# EasyEDA Pro project ProPrj_BLDCcontroller_2025-09-27.epro

# Schematic Schematic1
Board Name: Board1; Create Date: 2025-09-21; Page Name: P1; Project Name: BLDC驱动器; Schematic Name: Schematic1; Update Date: 2025-09-23; Company: 嘉立创EDA; Page Size: A4; Version: V1.0
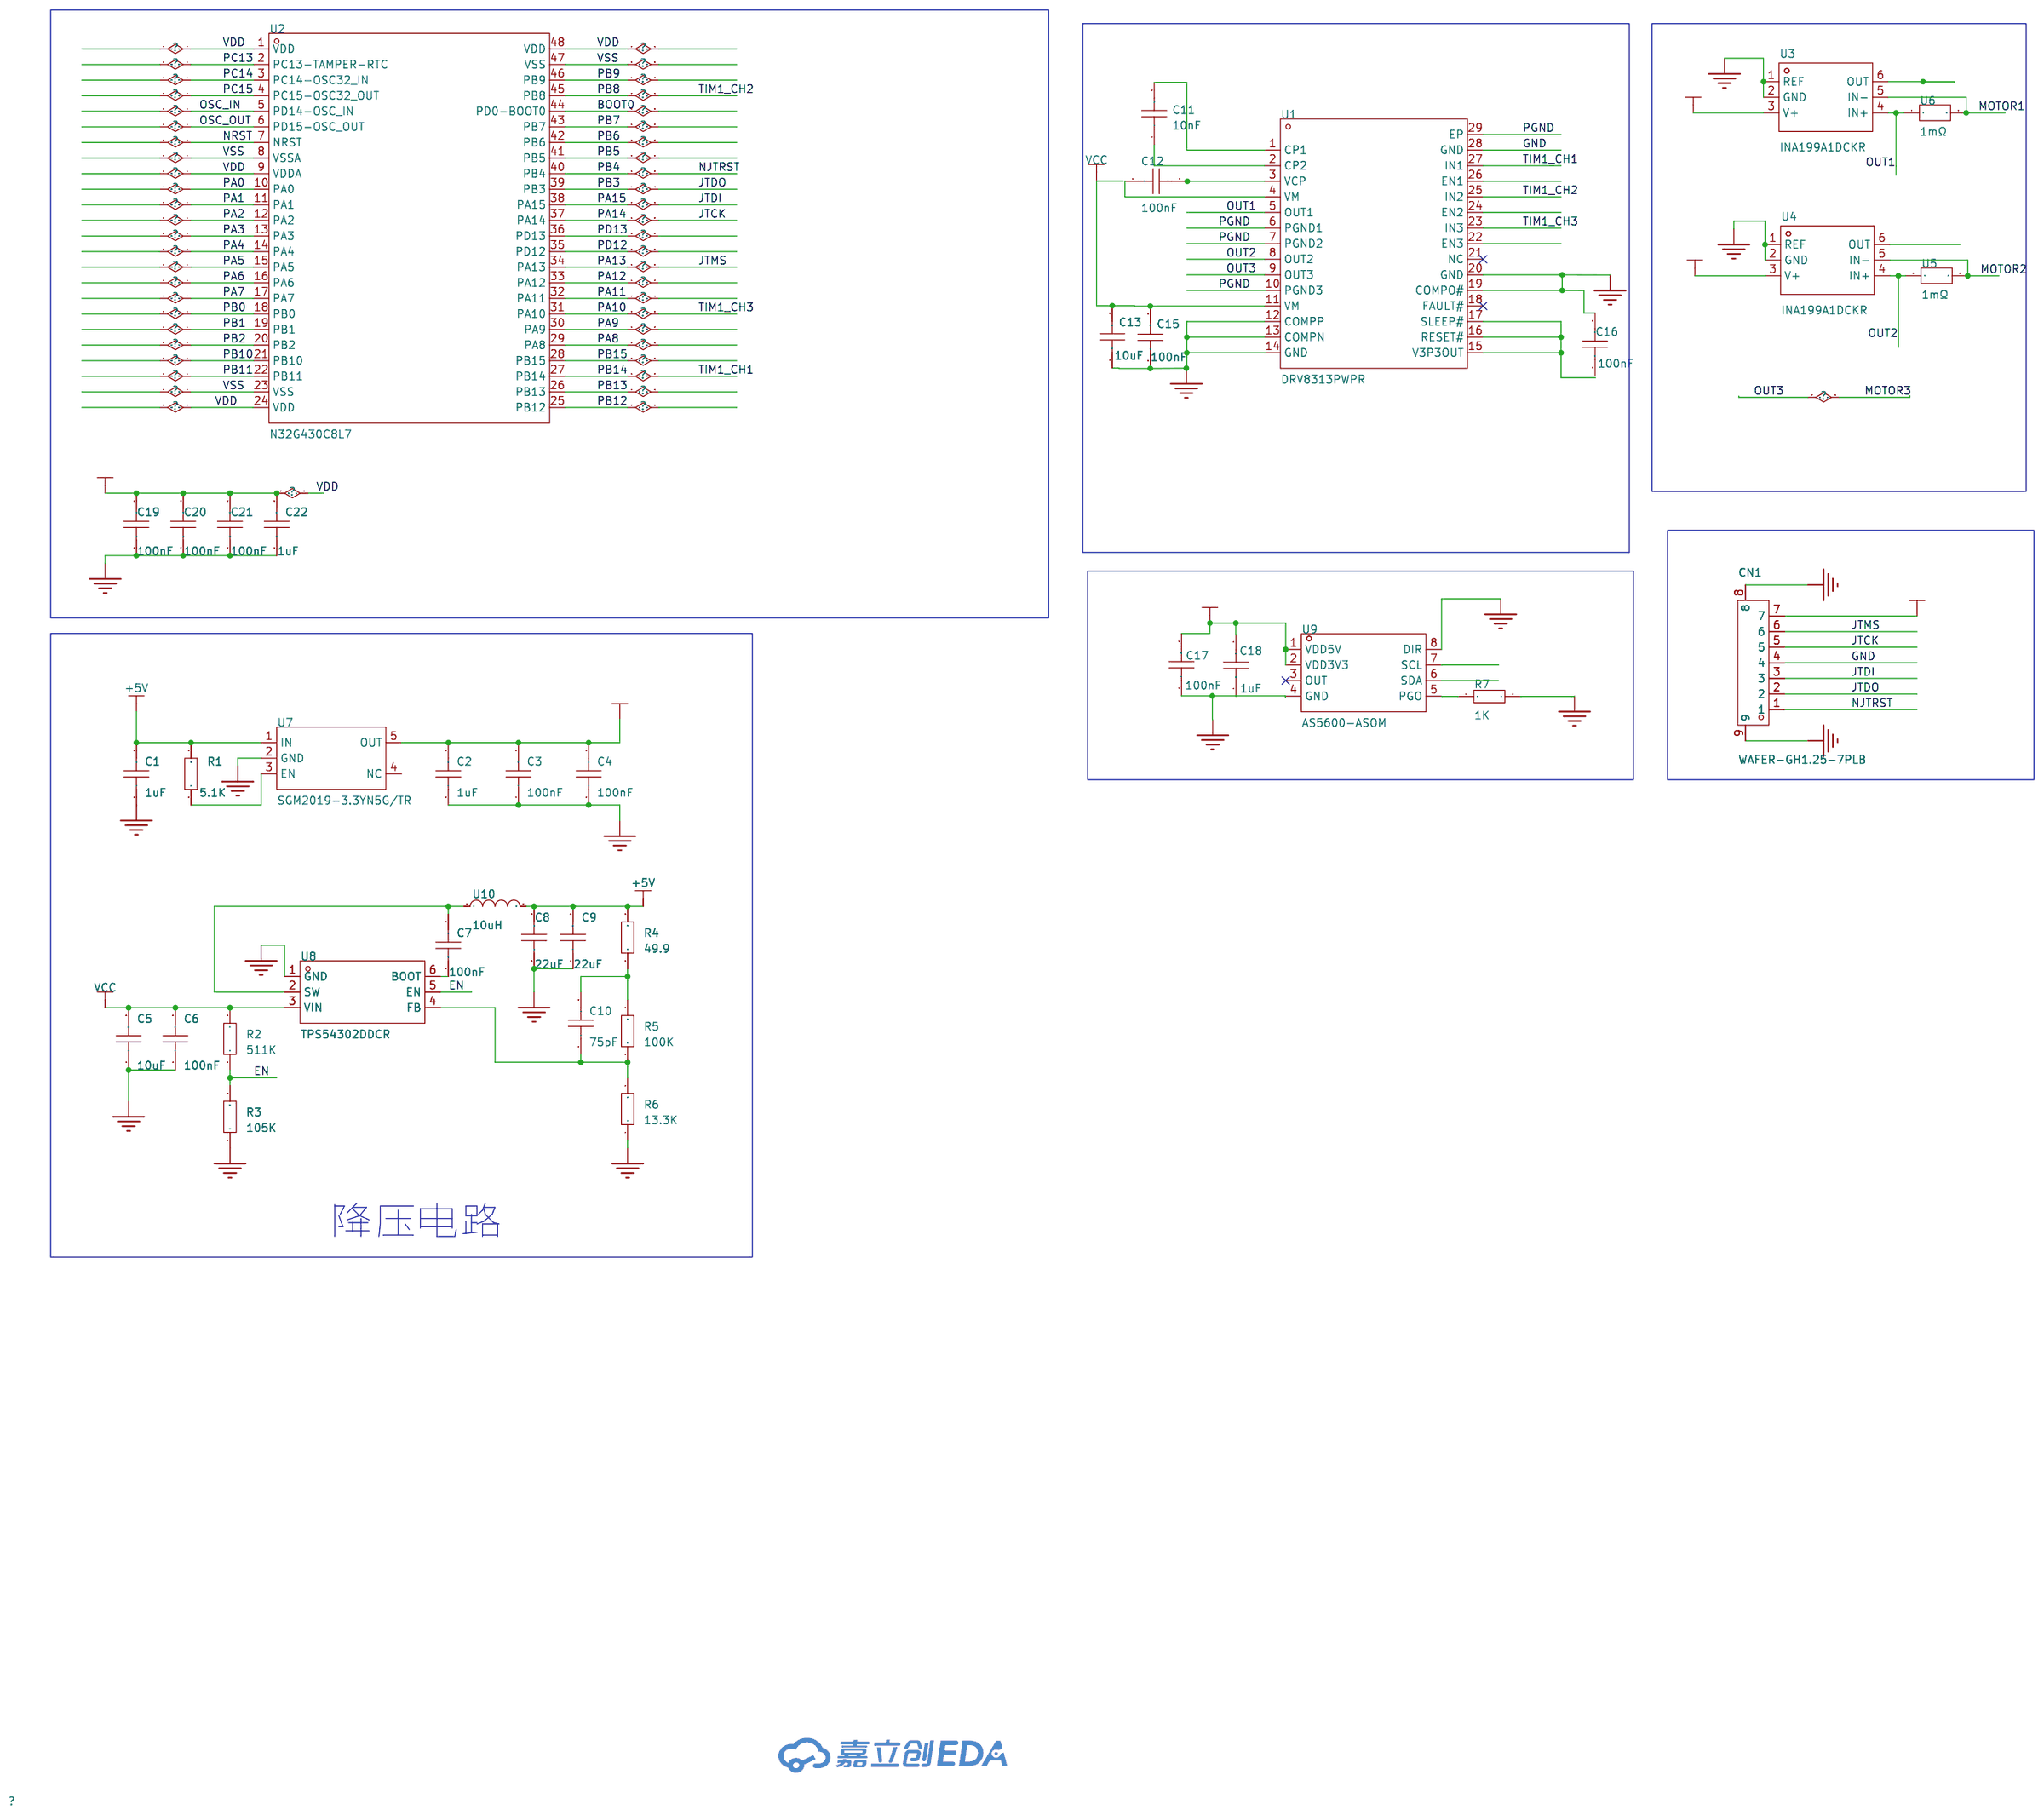
[diagram p0: schematic sheet]

## Parts
C1  1uF  [C0603]
C2  1uF  [C0603]
C3  100nF  [C0603]
C4  100nF  [C0603]
C5  10uF  [C0805]
C6  100nF  [C0603]
C7  100nF  [C0603]
C8  22uF  [C0805]
C9  22uF  [C0805]
C10  75pF  [C0805]
C11  10nF  [C0603]
C12  100nF  [C0603]
C13  10uF  [C0805]
C15  100nF  [C0603]
C16  100nF  [C0603]
C17  100nF  [C0603]
C18  1uF  [C0603]
C19  100nF  [C0603]
C20  100nF  [C0603]
C21  100nF  [C0603]
C22  1uF  [C0603]
CN1  WAFER-GH1.25-7PLB  [CONN-SMD_7P-P1.25_XUNPU_WAFER-GH1.25-7PLB]
R1  5.1K  [R0603]
R2  511K  [R0603]
R3  105K  [R0603]
R4  49.9  [R0603]
R5  100K  [R0603]
R6  13.3K  [R0603]
R7  1K  [R0603]
U1  DRV8313PWPR  [HTSSOP-28_L9.8-W4.5-P0.65-LS6.6-BL-EP]
U2  N32G430C8L7  [LQFP-48_L7.0-W7.0-P0.50-LS9.0-BL]
U3  INA199A1DCKR  [SC-70-6_L2.2-W1.3-P0.65-LS2.1-BR]
U4  INA199A1DCKR  [SC-70-6_L2.2-W1.3-P0.65-LS2.1-BR]
U5  1mΩ  [R1206]
U6  1mΩ  [R1206]
U7  SGM2019-3.3YN5G/TR  [SOT-23-5_L2.9-W1.6-P0.95-LS2.8-BR]
U8  TPS54302DDCR  [SOT-23-6_L2.9-W1.6-P0.95-LS2.8-BL]
U9  AS5600-ASOM  [SOIC-8_L5.0-W4.0-P1.27-LS6.0-BL]
U10  10uH  [IND-SMD_L4.4-W4.2]

## Library data of the parts
C1-C4 C6 C7 C11 C12 C15-C22 = CAP_0603: Supplier Footprint: 0603
C5 C8-C10 C13 = CAP_0805: Supplier Footprint: 0805
CN1 = WAFER-GH1.25-7PLB: 插针结构:1x7P;间距:1.25mm;安装方式:立贴;参考系列:GH;总PIN数:7P;排数:1;每排PIN数:7;行距:-;额定电流:1A;触头材质:黄铜;触头镀层:锡;工作温度:-25℃~+85℃;; LCSC Part Name: 1x7P 间距:1.25mm 立贴 系列:GH; Supplier Part: C3029373; Manufacturer: XUNPU(讯普); Supplier Footprint: SMD,P=1.25mm; JLCPCB Part Class: 扩展库; Datasheet: https://item.szlcsc.com/datasheet/WAFER-GH1.25-7PLB/3561385.html; Supplier: LCSC; Pins Structure: 1x7P; Pitch: 1.25mm; Mounting Type: 立贴; Reference Series: GH; Number of Pins: 7P; Number of Rows: 1; Number of PINs Per Row: 7; Current Rating: 1A; Contact Material: 黄铜; Contact Plating: 锡; Operating Temperature: -25℃~+85℃; Voltage Rating: 125V; Plastic Material: LCP; Supplementary Features: 辅助焊脚; Color: 米色; Z-Height of the Board: 4.2mm; X-Length of Bottom Edge on Board (Spacing Line): 12mm; Y-Width of Bottom Edge on Board: 4.95mm
R1-R7 = Res_0603: Supplier Footprint: 0603
U1 = DRV8313PWPR: DRV8313 具有集成 FET、65V 最大电压、3A 峰值电流的三相电机驱动器; LCSC Part Name: 无刷直流BLDC电机驱动芯片 60V; Supplier Part: C92482; Manufacturer: TI(德州仪器); Supplier Footprint: HTSSOP-28; JLCPCB Part Class: 扩展库; Datasheet: https://www.ti.com/cn/lit/gpn/drv8313; Supplier: LCSC; Drive Type: 三相; Integrated FETs: 是; Number of Half Bridges: 3; Peak Current: 2.5A; Quiescent Current(Iq): 800uA; Operating Temperature: -40℃~+125℃
U2 = N32G430C8L7: CPU内核:ARM-M4;应用领域:-;; Supplier Part: C3032170; Manufacturer: Nations(国民技术); Supplier Footprint: LQFP-48(7x7); JLCPCB Part Class: 扩展库; Datasheet: https://atta.szlcsc.com/upload/public/pdf/source/20220608/411F2C1C49F3955F5F0689A973473AF7.pdf; Supplier: LCSC; CPU Core: ARM-M4; Program Storage Size: 64KB; Program Memory Type: FLASH
U3 U4 = INA199A1DCKR: INA199 26V、双向电流感应放大器; Supplier Part: C59135; Manufacturer: TI(德州仪器); Supplier Footprint: SOT-363(SC-70-6); JLCPCB Part Class: 扩展库; Datasheet: https://www.ti.com/cn/lit/gpn/ina199; Supplier: LCSC; Supply Voltage: -300mV~26V; Supply Current: 300uA; Operating Temperature: -40℃~+125℃
U5 U6 = FRM121WFR001TM: 电阻类型:采样电阻;阻值:1mΩ;精度:±1%;工作电压:-;功率:1W;温度系数:±50ppm/℃;安装方式:-;; LCSC Part Name: 1mΩ ±1% 1W; Supplier Part: C7467246; Manufacturer: FOJAN(富捷); Supplier Footprint: 1206; JLCPCB Part Class: 扩展库; Datasheet: https://item.szlcsc.com/datasheet/FRM121WFR001TM/8513846.html; Supplier: LCSC; Type: 采样电阻; Tolerance: ±1%; Power(Watts): 1W; Temperature Coefficient: ±50ppm/℃
U7 = SGM2019-3.3YN5G/TR_C22447124: 输出类型:固定;工作电压:5.5V;输出电压:3.3V;输出电流:300mA;电源纹波抑制比(PSRR):80dB@(100Hz);输出极性:正极;; LCSC Part Name: JSM2019-3.3YN5G/TR; Supplier Part: C22447124; Manufacturer: JSMSEMI(杰盛微); Supplier Footprint: SOT-23-5; JLCPCB Part Class: 扩展库; Datasheet: https://atta.szlcsc.com/upload/public/pdf/source/20250120/A8D61688CD4A9C1FB653FDBB17463426.pdf; Supplier: LCSC; Output Type: 固定; Voltage - Supply: 5.5V; Output Voltage: 3.3V; Output Current: 300mA; Power Supply Rejection Ratio (PSRR): 80dB@(100Hz); Output Configuration: 正极; Number of Outputs: 1
U8 = TPS54302DDCR: 功能类型:降压型;输出类型:固定;工作电压:4.5V~28V;输出电压:5V;输出电流:3A;; LCSC Part Name: 4.5V至28V输入、3A输出、EMI友好的同步降压转换器; Supplier Part: C311983; Manufacturer: TI(德州仪器); Supplier Footprint: TSOT-23-6; JLCPCB Part Class: 扩展库; Datasheet: https://www.ti.com/cn/lit/gpn/tps54302; Supplier: LCSC; Function: 降压型; Output Type: 固定; Input Voltage: 4.5V~28V; Output Voltage: 5V; Output Current: 3A; Switching Frequency: 400kHz; Operating Temperature: -40℃~+125℃; Synchronous Rectification: 是; Number of Outputs: 1; Topology: 降压式; Quiescent Current (Iq): 45uA; Switch tube (built-in/external): 内置
U9 = AS5600-ASOM: 旋转角度范围:0°~360°;; Supplier Part: C79815; Manufacturer: ams(艾迈斯半导体); Supplier Footprint: SOIC-8; JLCPCB Part Class: 扩展库; Datasheet: https://atta.szlcsc.com/upload/public/pdf/source/20161027/1477535527192.pdf; Supplier: LCSC; Supply Voltage: 5V；3.3V; Rotation Angle: 0°~360°
U10 = XR0420-4R7M: 电感值:4.7uH;精度:±20%;额定电流:2.8A;饱和电流(Isat):3A;类型:一体成型电感;; LCSC Part Name: 4.7uH ±20% 3A; Supplier Part: C5307591; Manufacturer: XR(祥如); Supplier Footprint: SMD,0420; JLCPCB Part Class: 扩展库; Datasheet: https://atta.szlcsc.com/upload/public/pdf/source/20240328/110B611B724D24AB51078DA8F677E482.pdf; Supplier: LCSC; Tolerance: ±20%; Current Rating: 2.8A; Current - Saturation(Isat): 3A; DC Resistance(DCR): 105mΩ; Type: 一体成型电感

## Nets
3.3V: C2.2 C3.2 C4.2 C17.2 C19.2 C20.2 C21.2 C22.2 CN1.7 U2.1(VDD) U2.9(VDDA) U2.24(VDD) U2.48(VDD) U3.3(V+) U4.3(V+) U7.5(OUT) U9.1(VDD5V) U9.2(VDD3V3)
+5V: C1.2 C8.2 C9.2 R1.2 R4.2 U7.1(IN) U10.2
GND: C1.1 C2.1 C3.1 C4.1 C5.1 C6.1 C8.1 C9.1 C13.1 C15.1 C16.2 C17.1 C19.1 C20.1 C21.1 C22.1 CN1.4 CN1.8 CN1.9 R3.1 R6.1 R7.2 U1.12(COMPP) U1.13(COMPN) U1.14(GND) U1.19(COMPO#) U1.20(GND) U1.28(GND) U3.1(REF) U3.2(GND) U4.1(REF) U4.2(GND) U7.2(GND) U8.1(GND) U9.8(DIR)
PGND: U1.6(PGND1) U1.7(PGND2) U1.10(PGND3) U1.29(EP)
VCC: C5.2 C6.2 R2.2 U8.3(VIN)
VSS: U2.8(VSSA) U2.23(VSS) U2.47(VSS)
BOOT0: U2.44(PD0-BOOT0)
EN: R2.1 R3.2 U8.5(EN)
JTCK: CN1.5 U2.37(PA14)
JTDI: CN1.3 U2.38(PA15)
JTDO: CN1.2 U2.39(PB3)
JTMS: CN1.6 U2.34(PA13)
MOTOR1: U3.5(IN-) U6.2
MOTOR2: U4.5(IN-) U5.2
MOTOR3: U1.9(OUT3)
NJTRST: CN1.1 U2.40(PB4)
NRST: U2.7(NRST)
OSC_IN: U2.5(PD14-OSC_IN)
OSC_OUT: U2.6(PD15-OSC_OUT)
OUT1: U1.5(OUT1) U3.4(IN+) U6.1
OUT2: U1.8(OUT2) U4.4(IN+) U5.1
PA0: U2.10(PA0)
PA1: U2.11(PA1)
PA2: U2.12(PA2)
PA3: U2.13(PA3)
PA4: U2.14(PA4)
PA5: U2.15(PA5)
PA6: U2.16(PA6)
PA7: U2.17(PA7)
PA8: U2.29(PA8)
PA9: U2.30(PA9)
PA10: U1.23(IN3) U2.31(PA10)
PA11: U2.32(PA11)
PA12: U2.33(PA12)
PB0: U2.18(PB0)
PB1: U2.19(PB1)
PB2: U2.20(PB2)
PB5: U2.41(PB5)
PB6: U2.42(PB6)
PB7: U2.43(PB7)
PB8: U1.25(IN2) U2.45(PB8)
PB9: U2.46(PB9)
PB10: U2.21(PB10)
PB11: U2.22(PB11)
PB12: U2.25(PB12)
PB13: U2.26(PB13)
PB14: U1.27(IN1) U2.27(PB14)
PB15: U2.28(PB15)
PC13: U2.2(PC13-TAMPER-RTC)
PC14: U2.3(PC14-OSC32_IN)
PC15: U2.4(PC15-OSC32_OUT)
PD12: U2.35(PD12)
PD13: U2.36(PD13)
$1N321: U1.15(V3P3OUT) U1.16(RESET#) U1.17(SLEEP#)
$1N363: C12.2 U1.3(VCP)
$1N367: C11.2 U1.1(CP1)
$1N369: C11.1 U1.2(CP2)
$1N377: C12.1 U1.4(VM)
$1N3017: R1.1 U7.3(EN)
$1N3652: C7.2 U8.2(SW) U10.1
$1N3717: C7.1 U8.6(BOOT)
$1N4016: C10.2 R4.1 R5.2
$1N4167: C10.1 R5.1 R6.2 U8.4(FB)
$1N4739: C13.2 C15.2 U1.11(VM)

Not connected (* = marked no-connect by the designer): C16 1; C18 1 2; R7 1; U1 18(FAULT#)* 21(NC)* 22(EN3) 24(EN2) 26(EN1); U3 6(OUT); U4 6(OUT); U7 4(NC); U9 3(OUT)* 4(GND) 5(PGO) 6(SDA) 7(SCL)

## Notes on the sheet
- 降压电路

# Board PCB1
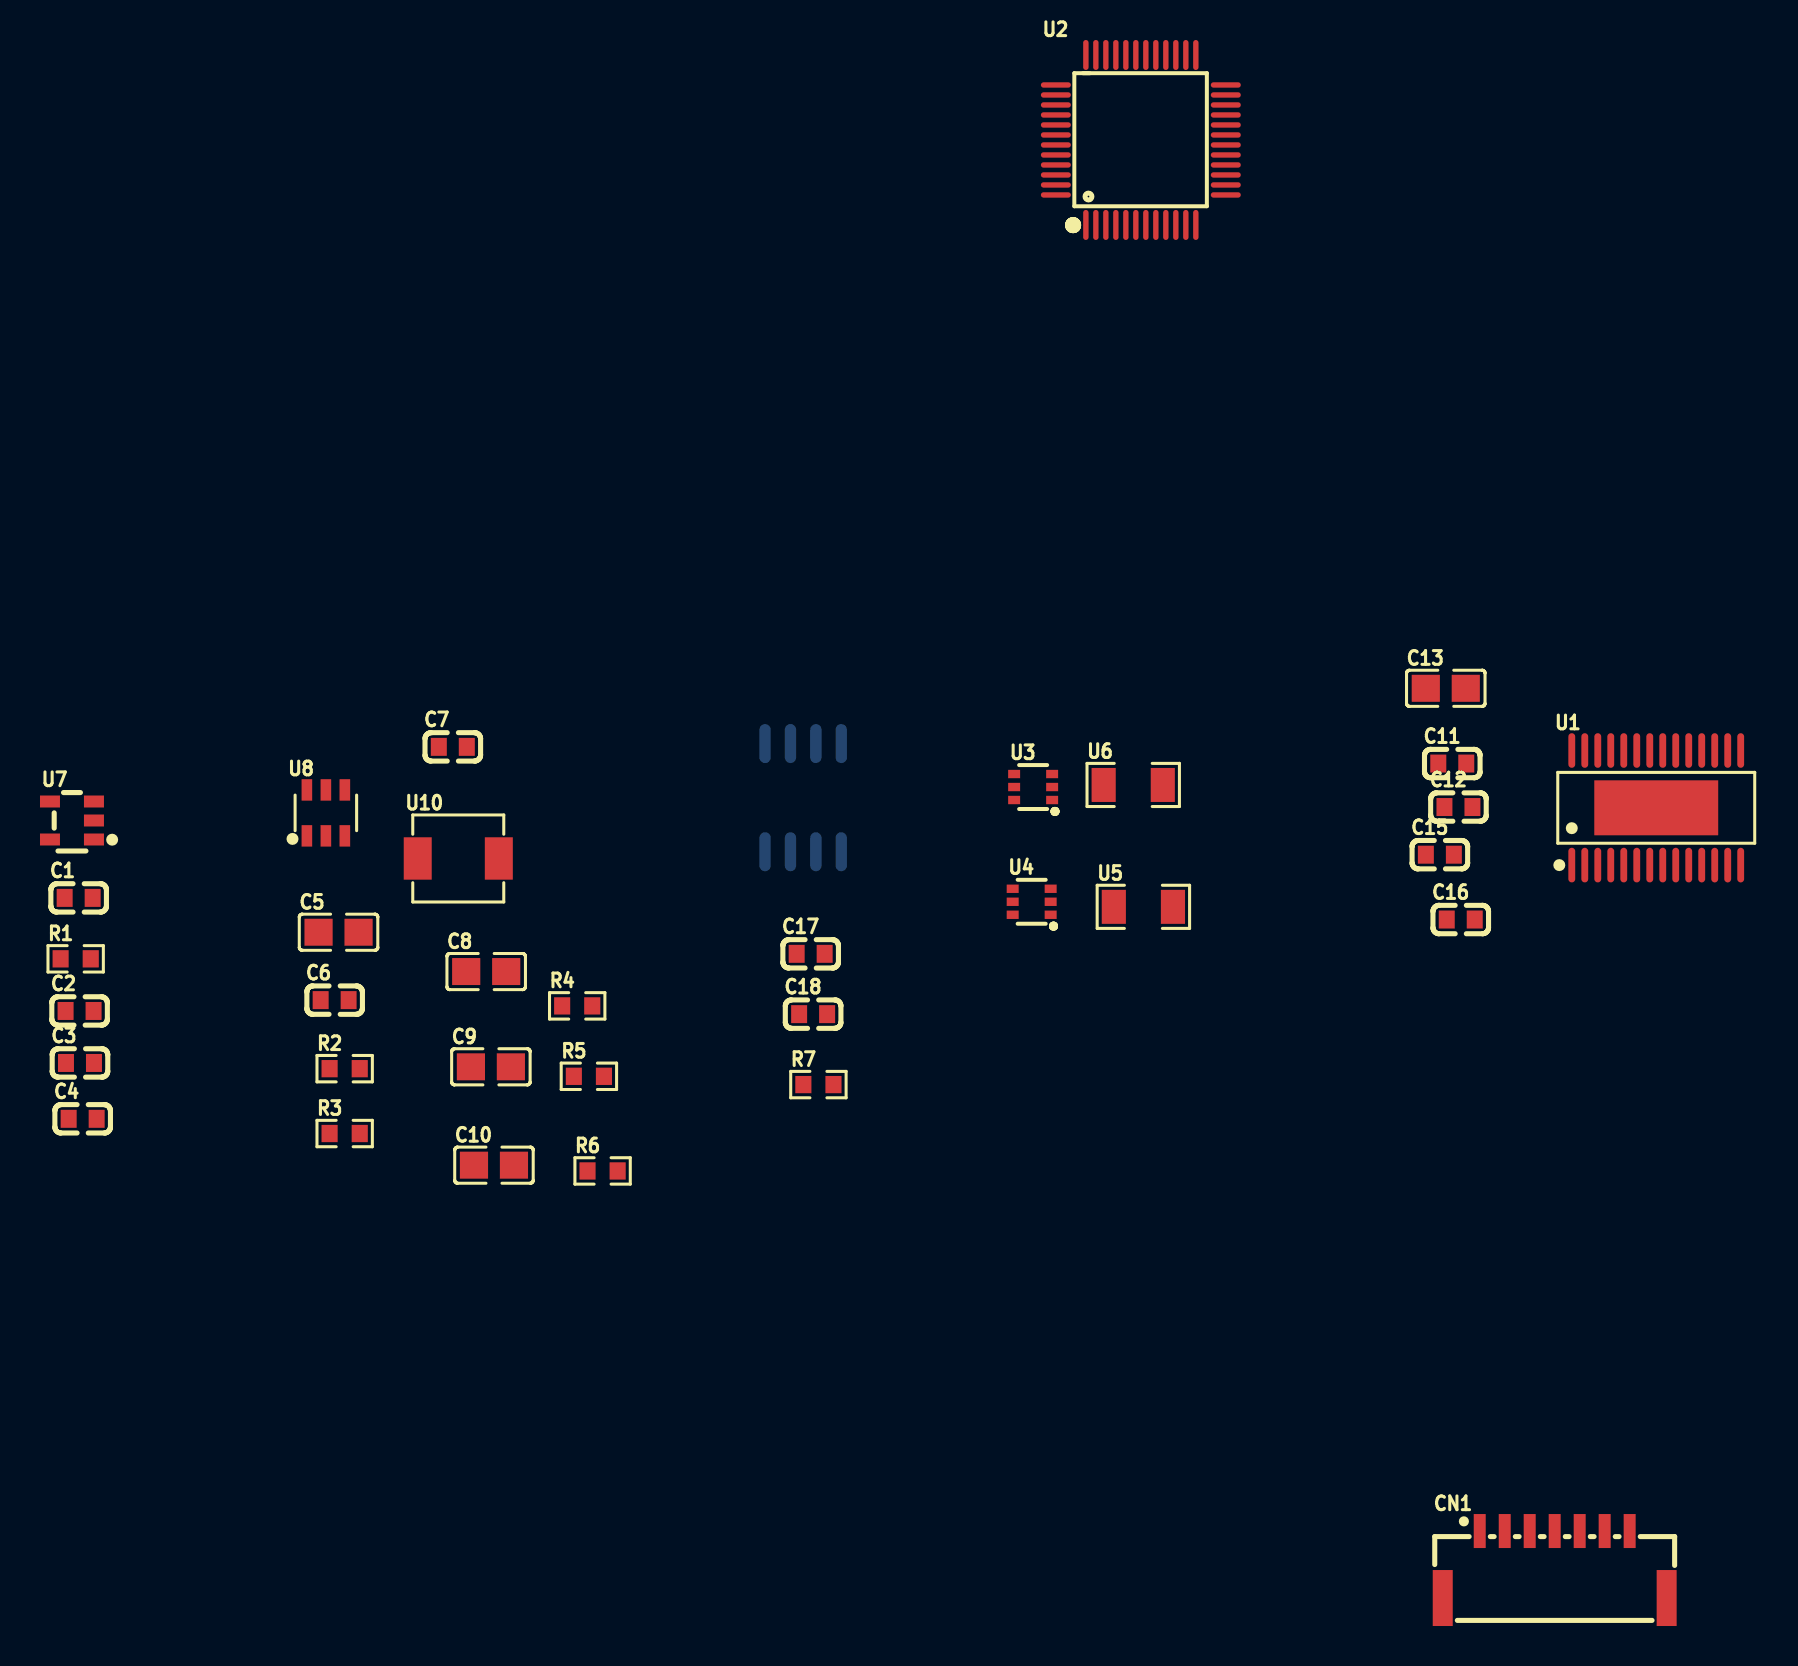
[diagram p1: board, top side]
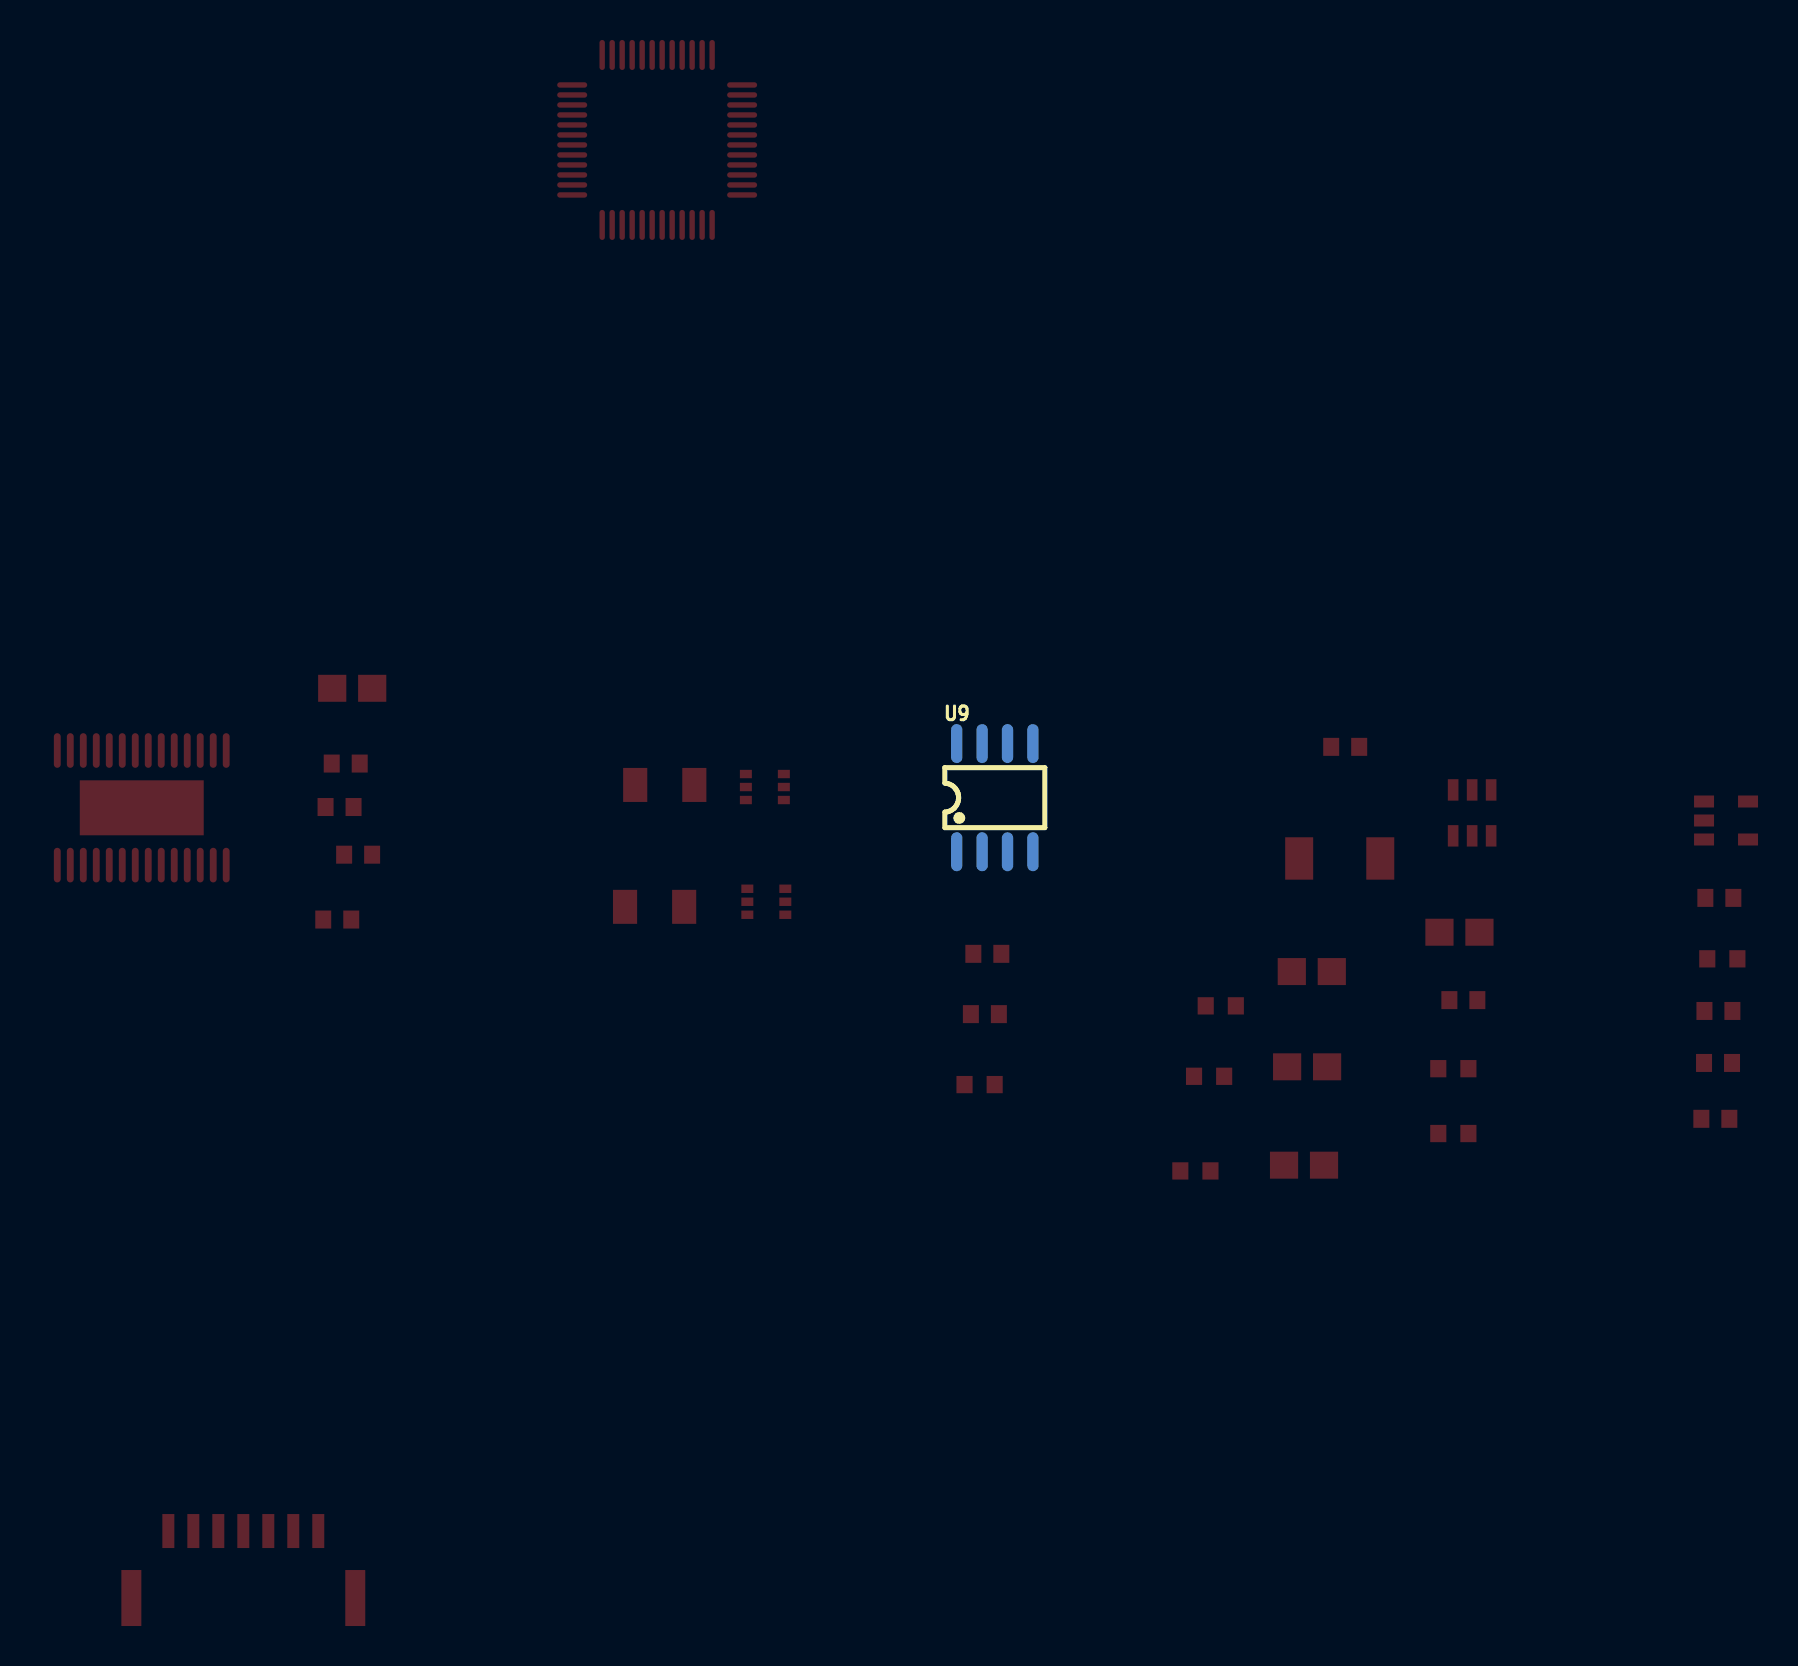
[diagram p2: board, bottom side, seen from below]

No outline. copper layers: Top Layer, Bottom Layer. Coordinates in mm from the lowest, leftmost part position.
Stack: Top Layer 0.035mm / Dielectric1 1.51mm FR4 er 4.5 / Bottom Layer 0.035mm

## Design rules (mm)
template: JLCPCB Capability(Two Layers Board)
spacing copperThickness1oz (default): track to track 0.102, other pairs 0.152 to 0.3
spacing copperThickness2oz: track to track 0.203, other pairs 0.152 to 0.3
track width copperThickness1oz (default): min 0.127, default 0.254, max 2.54
track width copperThickness2oz: min 0.203, default 0.254, max 2.54
differential pair differentialPair (default): width min 0.127, default 0.254, max 2.54; gap min 0.152, default 0.152
via viaSize (default): diameter min 0.5, default 0.61, max 10; hole min 0.3, default 0.305, max 6.3

## Placement (name value [footprint] x y rotation side)
C1  1uF  [C0603]  0.33 33.34 0 top
C2  1uF  [C0603]  0.38 27.69 0 top
C3  100nF  [C0603]  0.4 25.09 0 top
C4  100nF  [C0603]  0.54 22.29 0 top
C5  10uF  [C0805]  13.34 31.62 0 top
C6  100nF  [C0603]  13.14 28.23 0 top
C7  100nF  [C0603]  19.05 40.89 0 top
C8  22uF  [C0805]  20.72 29.66 0 top
C9  22uF  [C0805]  20.96 24.89 0 top
C10  75pF  [C0805]  21.11 19.97 0 top
C11  10nF  [C0603]  69.05 40.06 0 top
C12  100nF  [C0603]  69.35 37.88 0 top
C13  10uF  [C0805]  68.72 43.82 0 top
C15  100nF  [C0603]  68.42 35.5 0 top
C16  100nF  [C0603]  69.47 32.26 0 top
C17  100nF  [C0603]  36.95 30.54 0 top
C18  1uF  [C0603]  37.07 27.53 0 top
CN1  WAFER-GH1.25-7PLB  [CONN-SMD_7P-P1.25_XUNPU_WAFER-GH1.25-7PLB]  74.17 0 0 top
R1  5.1K  [R0603]  0.19 30.29 0 top
R2  511K  [R0603]  13.64 24.8 0 top
R3  105K  [R0603]  13.64 21.56 0 top
R4  49.9  [R0603]  25.27 27.94 0 top
R5  100K  [R0603]  25.86 24.42 0 top
R6  13.3K  [R0603]  26.54 19.69 0 top
R7  1K  [R0603]  37.34 24 0 top
U1  DRV8313PWPR  [HTSSOP-28_L9.8-W4.5-P0.65-LS6.6-BL-EP]  79.25 37.85 0 top
U2  N32G430C8L7  [LQFP-48_L7.0-W7.0-P0.50-LS9.0-BL]  53.47 71.25 0 top
U3  INA199A1DCKR  [SC-70-6_L2.2-W1.3-P0.65-LS2.1-BR]  48.08 38.88 0 top
U4  INA199A1DCKR  [SC-70-6_L2.2-W1.3-P0.65-LS2.1-BR]  48.01 33.15 0 top
U5  1mΩ  [R1206]  53.59 32.89 0 top
U6  1mΩ  [R1206]  53.09 38.99 0 top
U7  SGM2019-3.3YN5G/TR  [SOT-23-5_L2.9-W1.6-P0.95-LS2.8-BR]  0 37.21 0 top
U8  TPS54302DDCR  [SOT-23-6_L2.9-W1.6-P0.95-LS2.8-BL]  12.7 37.59 0 top
U9  AS5600-ASOM  [SOIC-8_L5.0-W4.0-P1.27-LS6.0-BL]  36.58 38.35 180 bottom
U10  10uH  [IND-SMD_L4.4-W4.2]  19.32 35.31 0 top

## Footprints (pads in the part's own frame, mm; a bottom-side part is the same pattern mirrored in y, then rotated)
C0603
  rect 0.8x0.9 smd: 1(-0.7,0) 2(0.7,0)
C0805
  rect 1.41x1.35 smd: 1(-1,0) 2(1,0)
CONN-SMD_7P-P1.25_XUNPU_WAFER-GH1.25-7PLB
  rect 0.6x1.7 smd: 1(-3.75,1.675) 2(-2.499,1.675) 3(-1.25,1.675) 4(0,1.675) 5(1.25,1.675) 6(2.5,1.675) 7(3.75,1.675)
  rect 1x2.8 smd: 8(5.6,-1.675) 9(-5.6,-1.675)
HTSSOP-28_L9.8-W4.5-P0.65-LS6.6-BL-EP
  oval 0.343x1.732 smd: 1(-4.225,-2.866) 2(-3.575,-2.866) 3(-2.925,-2.866) 4(-2.275,-2.866) 5(-1.625,-2.866) 6(-0.975,-2.866) 7(-0.325,-2.866) 8(0.325,-2.866) 9(0.975,-2.866) 10(1.625,-2.866) 11(2.275,-2.866) 12(2.925,-2.866) 13(3.575,-2.866) 14(4.225,-2.866) 15(4.225,2.866) 16(3.575,2.866) 17(2.925,2.866) 18(2.275,2.866) 19(1.625,2.866) 20(0.975,2.866) 21(0.325,2.866) 22(-0.325,2.866) 23(-0.975,2.866) 24(-1.625,2.866) 25(-2.275,2.866) 26(-2.925,2.866) 27(-3.575,2.866) 28(-4.225,2.866)
  rect 6.2x2.75 smd: 29(0,0)
IND-SMD_L4.4-W4.2
  rect 1.4x2.12 smd: 1(2.028,0) 2(-2.028,0)
LQFP-48_L7.0-W7.0-P0.50-LS9.0-BL
  oval 0.27x1.5 smd: 1(-2.75,-4.25) 2(-2.25,-4.25) 3(-1.75,-4.25) 4(-1.25,-4.25) 5(-0.75,-4.25) 6(-0.25,-4.25) 7(0.25,-4.25) 8(0.75,-4.25) 9(1.25,-4.25) 10(1.75,-4.25) 11(2.25,-4.25) 12(2.75,-4.25) 25(2.75,4.25) 26(2.25,4.25) 27(1.75,4.25) 28(1.25,4.25) 29(0.75,4.25) 30(0.25,4.25) 31(-0.25,4.25) 32(-0.75,4.25) 33(-1.25,4.25) 34(-1.75,4.25) 35(-2.25,4.25) 36(-2.75,4.25)
  oval 1.5x0.27 smd: 13(4.25,-2.75) 14(4.25,-2.25) 15(4.25,-1.75) 16(4.25,-1.25) 17(4.25,-0.75) 18(4.25,-0.25) 19(4.25,0.25) 20(4.25,0.75) 21(4.25,1.25) 22(4.25,1.75) 23(4.25,2.25) 24(4.25,2.75) 37(-4.25,2.75) 38(-4.25,2.25) 39(-4.25,1.75) 40(-4.25,1.25) 41(-4.25,0.75) 42(-4.25,0.25) 43(-4.25,-0.25) 44(-4.25,-0.75) 45(-4.25,-1.25) 46(-4.25,-1.75) 47(-4.25,-2.25) 48(-4.25,-2.75)
R0603
  rect 0.806x0.864 smd: 1(-0.753,0) 2(0.753,0)
R1206
  rect 1.208x1.701 smd: 1(-1.479,0) 2(1.479,0)
SC-70-6_L2.2-W1.3-P0.65-LS2.1-BR
  rect 0.6x0.42 smd: 1(0.95,-0.65) 2(0.95,0) 3(0.95,0.65) 4(-0.95,0.65) 5(-0.95,0) 6(-0.95,-0.65)
SOIC-8_L5.0-W4.0-P1.27-LS6.0-BL
  oval 0.569x1.95 smd: 1(-1.905,-2.705) 2(-0.635,-2.705) 3(0.635,-2.705) 4(1.905,-2.705) 5(1.905,2.705) 6(0.635,2.705) 7(-0.635,2.705) 8(-1.905,2.705)
SOT-23-5_L2.9-W1.6-P0.95-LS2.8-BR
  rect 1x0.6 smd: 1(1.1,-0.95) 2(1.1,0) 3(1.1,0.95) 4(-1.1,0.95) 5(-1.1,-0.95)
SOT-23-6_L2.9-W1.6-P0.95-LS2.8-BL
  rect 0.532x1.072 smd: 1(-0.95,-1.149) 2(0,-1.149) 3(0.95,-1.149) 4(0.95,1.149) 5(0,1.149) 6(-0.95,1.149)

## Nets
As in the schematic, except:
3.3V: C2.2 C3.2 C4.2 C17.2 C18.2 CN1.7 U3.3 U4.3 U7.5 U9.1 U9.2
GND: C1.1 C2.1 C3.1 C4.1 C5.1 C6.1 C8.1 C9.1 C13.1 C16.2 C17.1 CN1.4 CN1.8 CN1.9 R3.1 R6.1 R7.2 U1.12 U1.13 U1.14 U1.19 U1.20 U1.28 U3.1 U3.2 U4.1 U4.2 U7.2 U8.1 U9.4 U9.8
VDD: U2.1 U2.24 U2.48
VSS: U2.23 U2.47
$1N5232: R7.1 U9.5

Pads without a net: C15 1; C16 1; C18 1; U1 18 21; U7 4; U9 3
